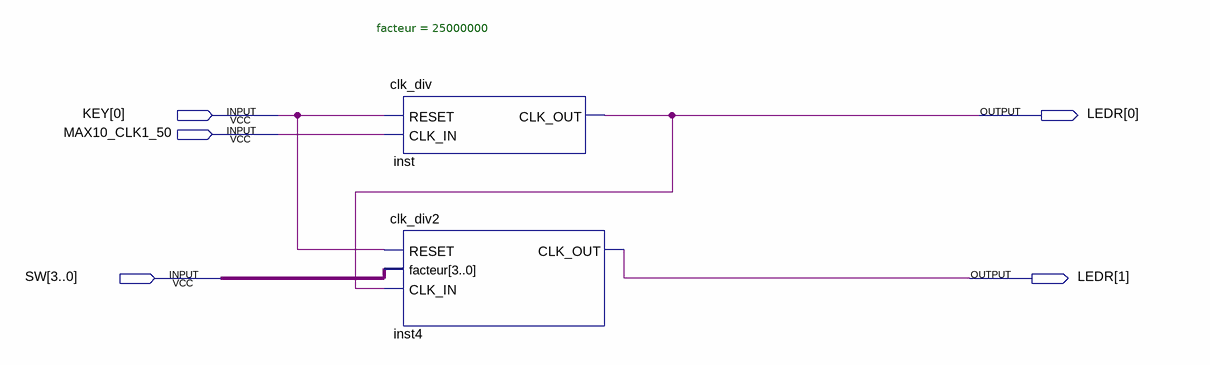
[diagram p0: schematic sheet]
// Quartus schematic clock_divider.bdf as structural Verilog: 2 symbols, 5 pins
module clock_divider (
  input  [0:0] KEY,
  input  MAX10_CLK1_50,
  input  [3:0] SW,
  output [1:0] LEDR
);

  clk_div #(.facteur(25000000)) inst (.RESET(KEY[0]), .CLK_IN(MAX10_CLK1_50), .CLK_OUT(LEDR[0]));
  clk_div2 inst4 (.RESET(KEY[0]), .facteur(SW), .CLK_IN(LEDR[0]), .CLK_OUT(LEDR[1]));
endmodule
